# Altium schematic sheet Sheet_1_2022-06-16.schdoc
size 307 x 216 mm
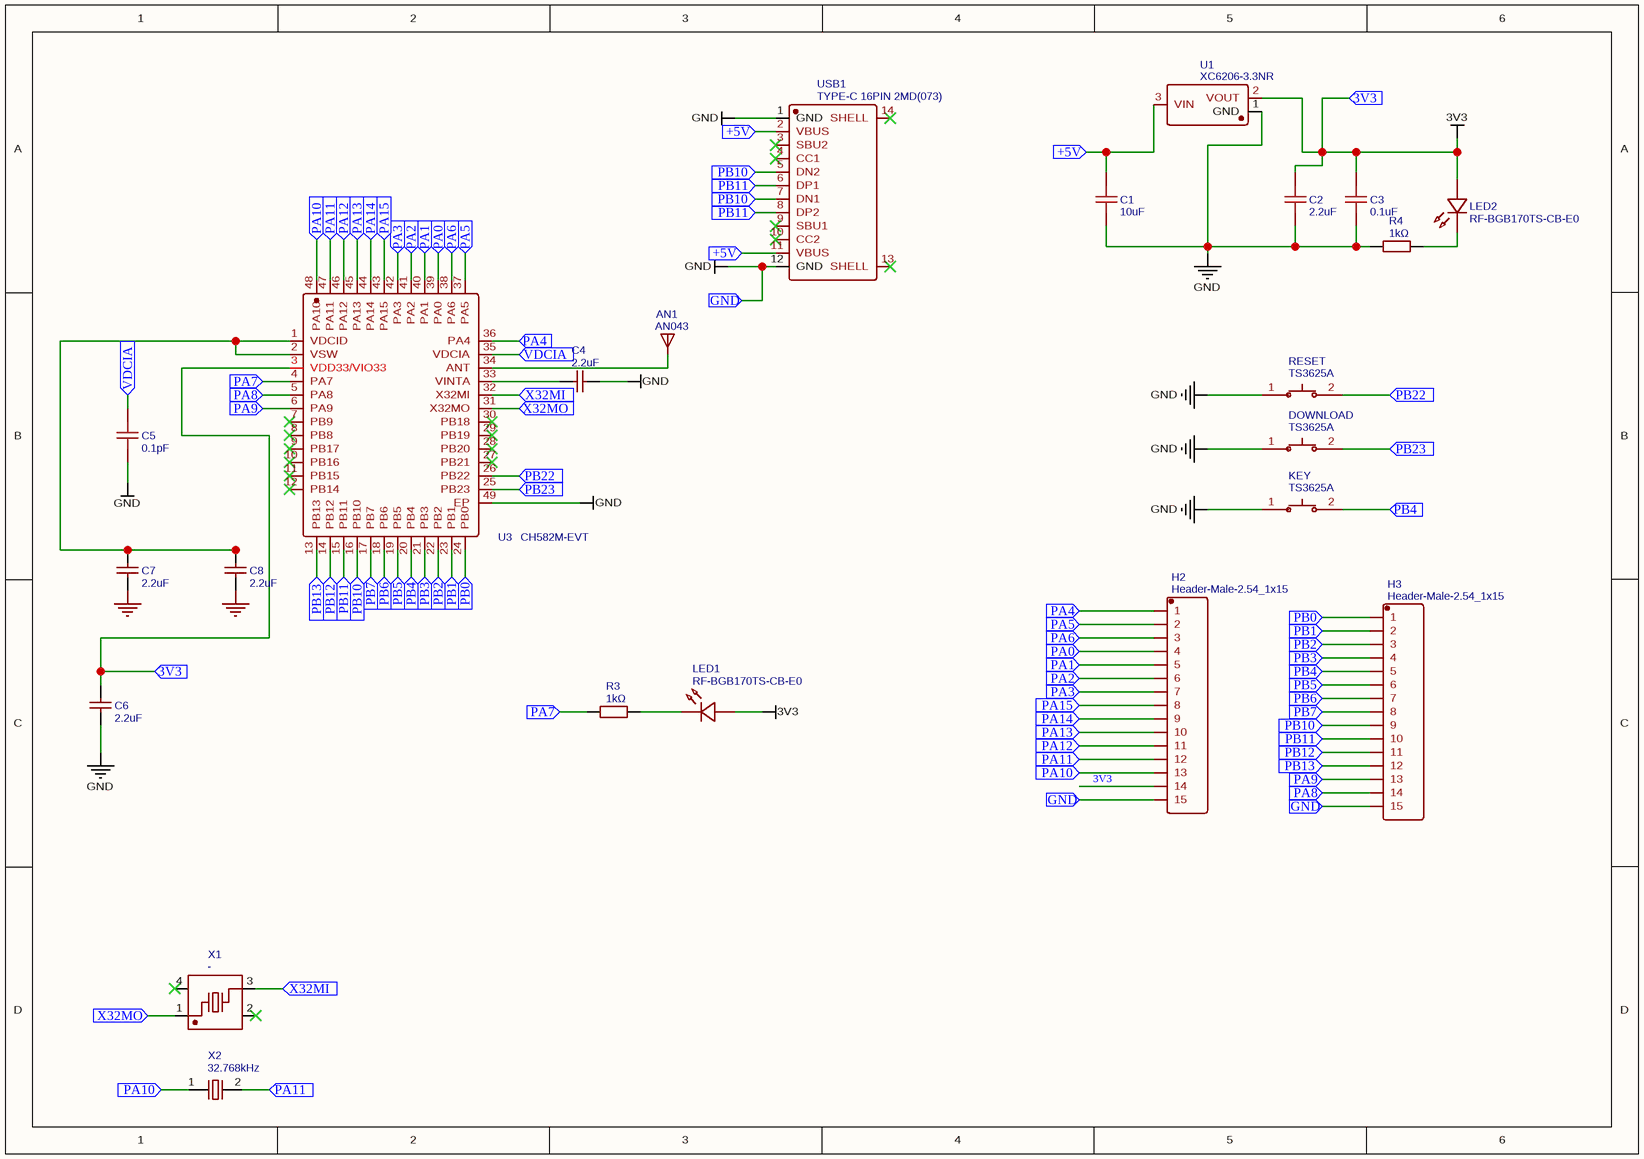
[diagram p0: Sheet_1_2022-06-16.schdoc]

## Parts
AN1  AN043  [AN043]
C1  10uF  [C0805]
C2  2.2uF  [C0805]
C3  0.1uF  [C0805]
C4  2.2uF  [C0805]
C5  0.1pF  [C0603]
C6  2.2uF  [C0805]
C7  2.2uF  [C0805]
C8  2.2uF  [C0805]
DOWNLOAD  TS3625A  [KEY-SMD_L6.0-W3.5-LS8.4]
H2  Header-Male-2.54_1x15  [HDR-TH_15P-P2.54-V-M]
H3  Header-Male-2.54_1x15  [HDR-TH_15P-P2.54-V-M]
KEY  TS3625A  [KEY-SMD_L6.0-W3.5-LS8.4]
LED1  RF-BGB170TS-CB-E0  [LED0805-RD_BLUE]
LED2  RF-BGB170TS-CB-E0  [LED0805-RD_BLUE]
R3  1kΩ  [R0805]
R4  1kΩ  [R0805]
RESET  TS3625A  [KEY-SMD_L6.0-W3.5-LS8.4]
U1  XC6206-3.3NR  [SOT-23-3_L2.9-W1.3-P0.95-LS2.4-BR]
U3  CH582M-EVT  [QFN-48_L5.0-W5.0-P0.35-BL-EP]
USB1  TYPE-C 16PIN 2MD(073)  [USB-C-SMD_TYPE-C-6PIN-2MD-073]
X1  -  [CRYSTAL-SMD_4P-L3.2-W2.5-BL]
X2  32.768kHz  [CRYSTAL-SMD_L3.2-W1.5]

## Ports
3V3 (in), +5V (in), GND (in), PA0 (in), PA1 (in), PA2 (in), PA3 (in), PA4 (in), PA5 (in), PA6 (in), PA7 (in), PA8 (in), PA9 (in), PA10 (in), PA11 (in), PA12 (in), PA13 (in), PA14 (in), PA15 (in), PB0 (in), PB1 (in), PB2 (in), PB3 (in), PB4 (in), PB5 (in), PB6 (in), PB7 (in), PB10 (in), PB11 (in), PB12 (in), PB13 (in), PB22 (in), PB23 (in), VDCIA (in), X32MI (in), X32MO (in)

## Nets
3V3: C2.2 C3.2 C6.2 H2.14 LED1.2(A) LED2.2(A) U1.2(VOUT) U3.3(VDD33/VIO33) ; port 3V3
GND: C1.1 C2.1 C3.1 C4.2 C5.1 C6.1 C7.1 C8.1 DOWNLOAD.1 H2.15 H3.15 KEY.1 R4.1 RESET.1 U1.1(GND) U3.49(EP) USB1.1(GND) USB1.12(GND) ; port GND
+5V: C1.2 U1.3(VIN) USB1.2(VBUS) USB1.11(VBUS) ; port +5V
PA0: H2.4 U3.39(PA0) ; port PA0
PA1: H2.5 U3.40(PA1) ; port PA1
PA2: H2.6 U3.41(PA2) ; port PA2
PA3: H2.7 U3.42(PA3) ; port PA3
PA4: H2.1 U3.36(PA4) ; port PA4
PA5: H2.2 U3.37(PA5) ; port PA5
PA6: H2.3 U3.38(PA6) ; port PA6
PA7: R3.2 U3.4(PA7) ; port PA7
PA8: H3.14 U3.5(PA8) ; port PA8
PA9: H3.13 U3.6(PA9) ; port PA9
PA10: H2.13 U3.48(PA10) X2.1 ; port PA10
PA11: H2.12 U3.47(PA11) X2.2 ; port PA11
PA12: H2.11 U3.46(PA12) ; port PA12
PA13: H2.10 U3.45(PA13) ; port PA13
PA14: H2.9 U3.44(PA14) ; port PA14
PA15: H2.8 U3.43(PA15) ; port PA15
PB0: H3.1 U3.24(PB0) ; port PB0
PB1: H3.2 U3.23(PB1) ; port PB1
PB2: H3.3 U3.22(PB2) ; port PB2
PB3: H3.4 U3.21(PB3) ; port PB3
PB4: H3.5 KEY.2 U3.20(PB4) ; port PB4
PB5: H3.6 U3.19(PB5) ; port PB5
PB6: H3.7 U3.18(PB6) ; port PB6
PB7: H3.8 U3.17(PB7) ; port PB7
PB10: H3.9 U3.16(PB10) USB1.5(DN2) USB1.7(DN1) ; port PB10
PB11: H3.10 U3.15(PB11) USB1.6(DP1) USB1.8(DP2) ; port PB11
PB12: H3.11 U3.14(PB12) ; port PB12
PB13: H3.12 U3.13(PB13) ; port PB13
PB22: RESET.2 U3.26(PB22) ; port PB22
PB23: DOWNLOAD.2 U3.25(PB23) ; port PB23
VDCIA: C5.2 C7.2 C8.2 U3.1(VDCID) U3.2(VSW) U3.35(VDCIA) ; port VDCIA
X32MI: U3.32(X32MI) X1.3 ; port X32MI
X32MO: U3.31(X32MO) X1.1 ; port X32MO
NetAN1_1: AN1.1 U3.34(ANT)
NetC4_1: C4.1 U3.33(VINTA)
NetLED1_1: LED1.1(K) R3.1
NetLED2_1: LED2.1(K) R4.2

Not connected (* = marked no-connect by the designer): U3 7(PB9)* 8(PB8)* 9(PB17)* 10(PB16)* 11(PB15)* 12(PB14)* 27(PB21)* 28(PB20)* 29(PB19)* 30(PB18)*; USB1 3(SBU2)* 4(CC1)* 9(SBU1)* 10(CC2)* 13(SHELL)* 14(SHELL)*; X1 2(GND)* 4(GND)*

## Library data of the parts
AN1 = AN043: Contributor: OrdosX; link: https://www.ti.com/lit/an/swra117d/swra117d.pdf; spicePre: A; spiceSymbolName: AN043
C1 = 10uF: BOM_Manufacturer: YAGEO; BOM_Manufacturer Part: CC0805MKY5V6BB106; nameAlias: Capacitance; Contributor: LCSC; BOM_Supplier: LCSC; BOM_Supplier Part: C520050; BOM_JLCPCB Part Class: Extended Part; spicePre: C; spiceSymbolName: CC0805MKY5V6BB106
C2 = 2.2uF: BOM_Manufacturer: YAGEO; BOM_Manufacturer Part: CC0805MKY5V6BB106; nameAlias: Capacitance; Contributor: LCSC; BOM_Supplier: LCSC; BOM_Supplier Part: C520050; BOM_JLCPCB Part Class: Extended Part; spicePre: C; spiceSymbolName: CC0805MKY5V6BB106
C3 = 0.1uF: BOM_Manufacturer: YAGEO; BOM_Manufacturer Part: CC0805MKY5V6BB106; nameAlias: Capacitance; Contributor: LCSC; BOM_Supplier: LCSC; BOM_Supplier Part: C520050; BOM_JLCPCB Part Class: Extended Part; spicePre: C; spiceSymbolName: CC0805MKY5V6BB106
C4 C6-C8 = 2.2uF: BOM_Manufacturer: YAGEO; BOM_Manufacturer Part: CC0805KKX7R9BB225; nameAlias: Capacitance; Contributor: LCSC; BOM_Supplier: LCSC; BOM_Supplier Part: C125847; BOM_JLCPCB Part Class: Extended Part; spicePre: C; spiceSymbolName: CC0805KKX7R9BB225
C5 = 0.1pF: BOM_Manufacturer: FH(风华); BOM_Manufacturer Part: 0603CG0R1C500NT; nameAlias: Capacitance; Contributor: LCSC; BOM_Supplier: LCSC; BOM_Supplier Part: C1322361; BOM_JLCPCB Part Class: Extended Part; spicePre: C; spiceSymbolName: 0603CG0R1C500NT
DOWNLOAD KEY RESET = TS3625A: BOM_Manufacturer: SHOU HAN; Contributor: LCSC; BOM_Supplier: LCSC; BOM_Supplier Part: C398053; BOM_Manufacturer Part: TS3625A; BOM_JLCPCB Part Class: Extended Part; spicePre: S; spiceSymbolName: TS3625A
H2 H3 = Header-Male-2.54_1x15: BOM_Manufacturer: Ckmtw; BOM_Manufacturer Part: 210S-1*15P L=11.6MMGold-plated black; Contributor: LCSC; BOM_Supplier: LCSC; BOM_Supplier Part: C124373; BOM_JLCPCB Part Class: Extended Part; spicePre: H; spiceSymbolName: Header-Male-2.54_1x15
LED1 LED2 = RF-BGB170TS-CB-E0: BOM_Manufacturer: Refond(瑞丰); Contributor: LCSC; BOM_Supplier: LCSC; BOM_Supplier Part: C2908306; BOM_Manufacturer Part: RF-BGB170TS-CB-E0; BOM_JLCPCB Part Class: Extended Part; spicePre: L; spiceSymbolName: RF-BGB170TS-CB-E0
R3 R4 = 1kΩ: BOM_Manufacturer: FH; BOM_Manufacturer Part: RS-05K1001FT; nameAlias: Resistance; Resistance (Ohms): 1K; BOM_Supplier: LCSC; BOM_Supplier Part: C115316; BOM_JLCPCB Part Class: Extended Part; spicePre: R; spiceSymbolName: RS-05K1001FT
U1 = XC6206-3.3NR: BOM_Manufacturer: HX(恒佳兴); Contributor: lcsc; BOM_Supplier: LCSC; BOM_Supplier Part: C2984874; BOM_Manufacturer Part: XC6206-3.3NR; link: https://atta.szlcsc.com/upload/public/pdf/source/20220328/86A37D0E6EE2F6DF94D50B2B86284E3B.pdf; spicePre: U; spiceSymbolName: XC6206-3.3NR
U3 = CH582M-EVT: BOM_Manufacturer: WCH(南京沁恒); Contributor: LCSC; BOM_Supplier: LCSC; BOM_Supplier Part: C2943981; BOM_Manufacturer Part: CH582M-EVT; spicePre: U; spiceSymbolName: CH582M-EVT
USB1 = TYPE-C 16PIN 2MD(073): BOM_Manufacturer: SHOU HAN(首韩); Contributor: LCSC; BOM_Supplier: LCSC; BOM_Supplier Part: C2765186; BOM_Manufacturer Part: TYPE-C 16PIN 2MD(073); BOM_JLCPCB Part Class: Extended Part; spicePre: U; spiceSymbolName: TYPE-C 16PIN 2MD(073)
X1 = -: BOM_Manufacturer: TST; BOM_Manufacturer Part: TZ0375A; nameAlias: Frequency; Contributor: LCSC; BOM_Supplier: LCSC; BOM_Supplier Part: C498198; BOM_JLCPCB Part Class: Extended Part; spicePre: X; spiceSymbolName: TZ0375A
X2 = 32.768kHz: BOM_Manufacturer: HD; BOM_Manufacturer Part: 7N032768NW2; nameAlias: Frequency; Contributor: LCSC; BOM_Supplier: LCSC; BOM_Supplier Part: C655072; BOM_JLCPCB Part Class: Extended Part; spicePre: X; spiceSymbolName: 7N032768NW2